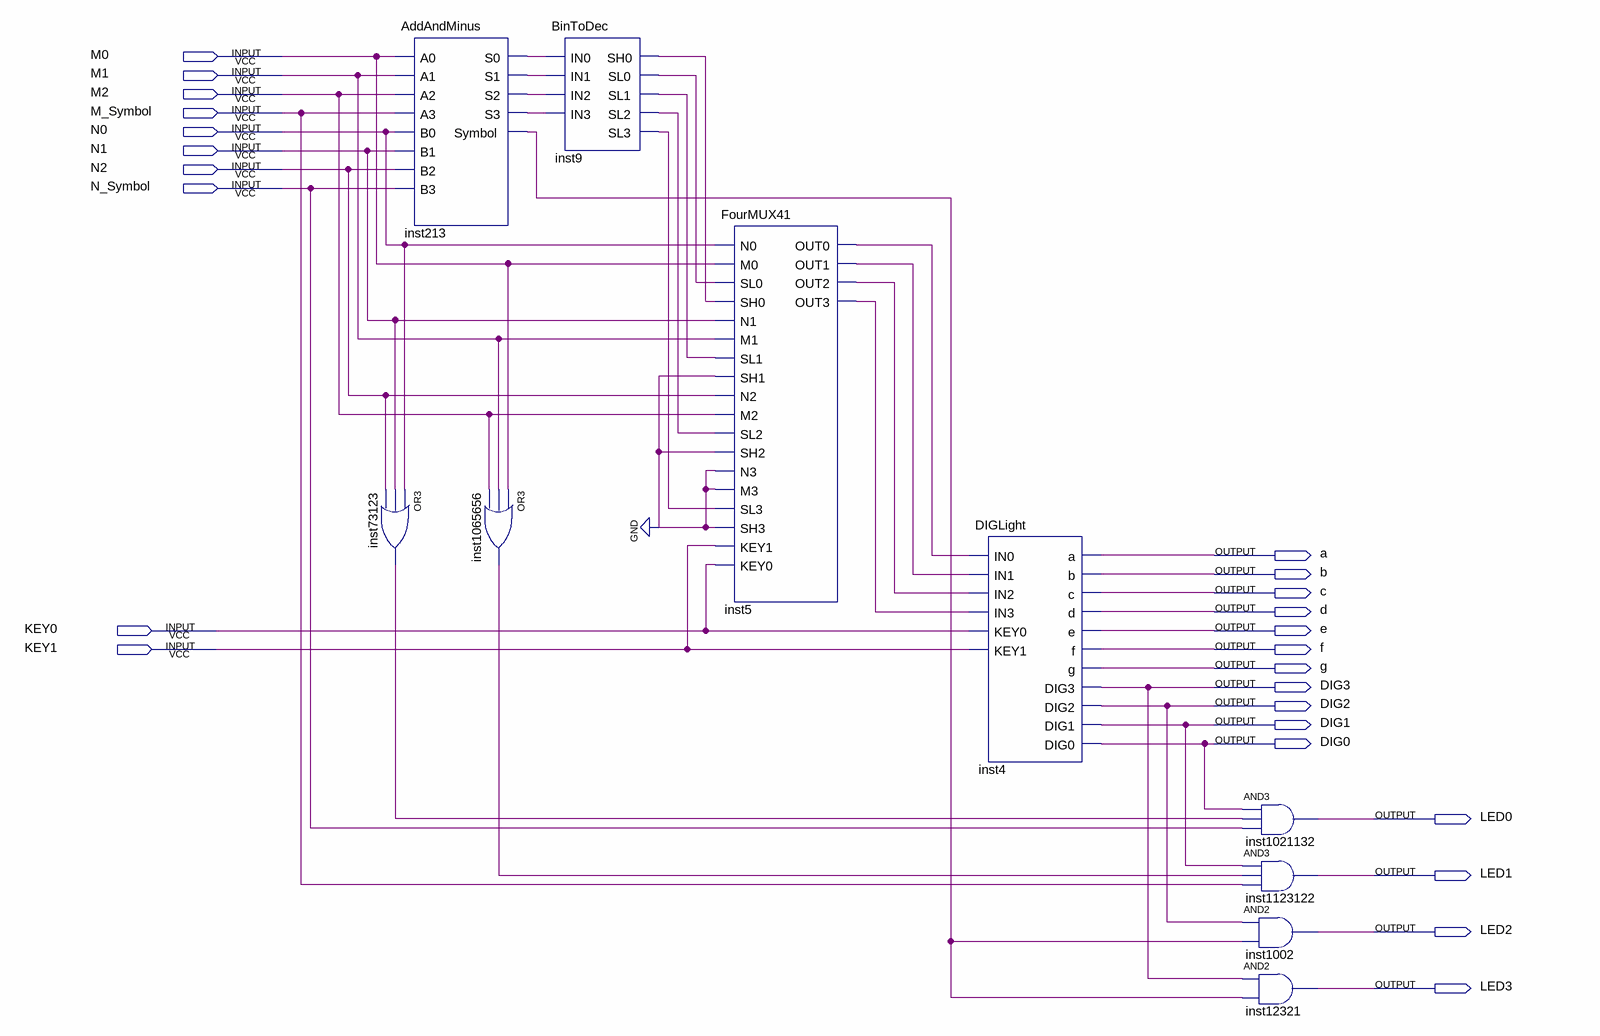
[diagram p0: schematic sheet]
// Quartus schematic Final.bdf as structural Verilog: 10 symbols, 25 pins
module Final (
  input  M0,
  input  M1,
  input  M2,
  input  M_Symbol,
  input  N0,
  input  N1,
  input  N2,
  input  N_Symbol,
  input  KEY0,
  input  KEY1,
  output a,
  output b,
  output c,
  output d,
  output e,
  output f,
  output g,
  output DIG3,
  output DIG2,
  output DIG1,
  output DIG0,
  output LED0,
  output LED1,
  output LED2,
  output LED3
);

  wire inst5_out0, inst5_out1, inst5_out2, inst5_out3, inst9_sh0, inst9_sl0, inst9_sl1, inst9_sl2, inst9_sl3,
       inst213_s0, inst213_s1, inst213_s2, inst213_s3, inst213_symbol, inst73123_out, inst1065656_out;

  AddAndMinus inst213 (
    .A0(M0), .A1(M1), .A2(M2), .A3(M_Symbol), .B0(N0), .B1(N1), .B2(N2), .B3(N_Symbol), .S0(inst213_s0),
    .S1(inst213_s1), .S2(inst213_s2), .S3(inst213_s3), .Symbol(inst213_symbol));
  or inst73123 (inst73123_out, N0, N1, N2);
  or inst1065656 (inst1065656_out, M0, M1, M2);
  BinToDec inst9 (
    .IN0(inst213_s0), .IN1(inst213_s1), .IN2(inst213_s2), .IN3(inst213_s3), .SH0(inst9_sh0), .SL0(inst9_sl0),
    .SL1(inst9_sl1), .SL2(inst9_sl2), .SL3(inst9_sl3));
  FourMUX41 inst5 (
    .N0(N0), .M0(M0), .SL0(inst9_sl0), .SH0(inst9_sh0), .N1(N1), .M1(M1), .SL1(inst9_sl1), .SH1(1'b0),
    .N2(N2), .M2(M2), .SL2(inst9_sl2), .SH2(1'b0), .N3(1'b0), .M3(1'b0), .SL3(inst9_sl3), .SH3(1'b0),
    .KEY1(KEY1), .KEY0(KEY0), .OUT0(inst5_out0), .OUT1(inst5_out1), .OUT2(inst5_out2), .OUT3(inst5_out3));
  DIGLight inst4 (
    .IN0(inst5_out0), .IN1(inst5_out1), .IN2(inst5_out2), .IN3(inst5_out3), .KEY0(KEY0), .KEY1(KEY1), .a(a),
    .b(b), .c(c), .d(d), .e(e), .f(f), .g(g), .DIG3(DIG3), .DIG2(DIG2), .DIG1(DIG1), .DIG0(DIG0));
  and inst1021132 (LED0, DIG0, inst73123_out, N_Symbol);
  and inst1123122 (LED1, DIG1, inst1065656_out, M_Symbol);
  and inst1002 (LED2, DIG2, inst213_symbol);
  and inst12321 (LED3, DIG3, inst213_symbol);
endmodule
